# EAGLE design sensor02 (EAGLE 7.2.0)
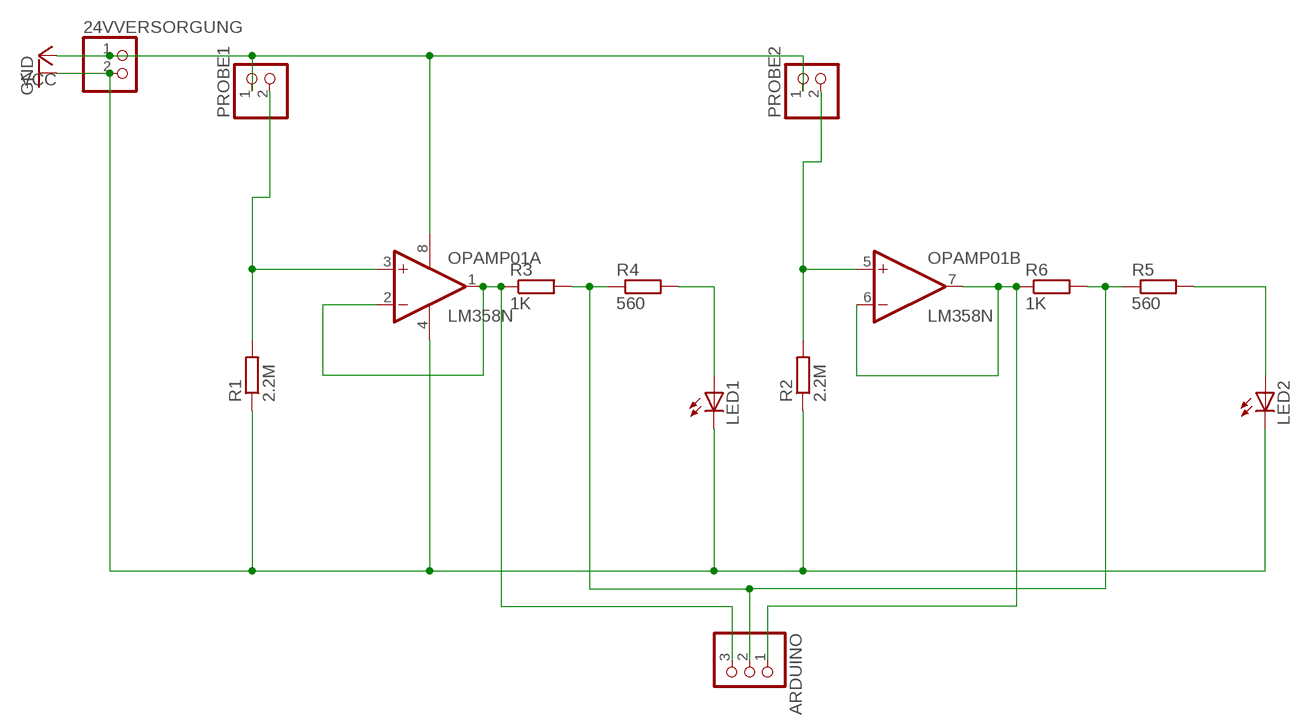
[diagram p0: schematic, sheet 1]

## Parts
24VVERSORGUNG  PINHD-1X2  [1X02]
ARDUINO  PINHD-1X3  [1X03]
LED1  LED5MM  [LED5MM]
LED2  LED5MM  [LED5MM]
OPAMP01  LM358N  [DIL08]
PROBE1  PINHD-1X2  [1X02]
PROBE2  PINHD-1X2  [1X02]
R1  2.2M  R-EU_0207/7  [0207/7]
R2  2.2M  R-EU_0207/7  [0207/7]
R3  1K  R-EU_0207/7  [0207/7]
R4  560  R-EU_0207/7  [0207/7]
R5  560  R-EU_0207/7  [0207/7]
R6  1K  R-EU_0207/7  [0207/7]

## Nets
GND: 24VVERSORGUNG.2 LED1.K(C) LED2.K(C) OPAMP01.4(P:V-) R1.1 R2.1
N$1: OPAMP01.3(A:+IN) PROBE1.2 R1.2
N$2: OPAMP01.5(B:+IN) PROBE2.2 R2.2
N$3: ARDUINO.3 OPAMP01.1(A:OUT) OPAMP01.2(A:-IN) R3.1
N$4: LED1.A R4.2
N$6: ARDUINO.1 OPAMP01.6(B:-IN) OPAMP01.7(B:OUT) R6.1
N$7: ARDUINO.2 R3.2 R4.1 R5.1 R6.2
N$8: LED2.A R5.2
VCC: 24VVERSORGUNG.1 OPAMP01.8(P:V+) PROBE1.1 PROBE2.1

## Library data of the parts
24VVERSORGUNG PROBE1 PROBE2 = pinhead:PINHD-1X2: PIN HEADER
ARDUINO = pinhead:PINHD-1X3: PIN HEADER
LED1 LED2 = led:LED: LED OSRAM: - CHIPLED LG R971, LG N971, LY N971, LG Q971, LY Q971, LO R971, LY R971 LH N974, LH R974 LS Q976, LO Q976, LY Q976 LO Q996 - Hyper CHIPLED LW Q18S LB Q993, LB Q99A, LB R99A - SideLED LS A670, LO A670, LY A670, LG A670, LP A670 LB A673, LV A673, LT A673, LW A673 LH A674 LY A675 LS A676, LA A676, LO A676, LY A676, LW A676 LS A679, LY A679, LG A679 - Hyper Micro SIDELED® LS Y876, LA Y876, LO Y876, LY Y876 LT Y87S - SmartLED LW L88C, LW L88S LB L89C, LB L89S, LG L890 LS L89K, LO L89K, LY L89K LS L896, LA L896, LO L896, LY L896 - TOPLED LS T670, LO T670, LY T670, LG T670, LP T670 LSG T670, LSP T670, LSY T670, LOP T670, LYG T670 LG T671, LOG T671, LSG T671 LB T673, LV T673, LT T673, LW T673 LH T674 LS T676, LA T676, LO T676, LY T676, LB T676, LH T676, LSB T676, LW T676 LB T67C, LV T67C, LT T67C, LS T67K, LO T67K, LY T67K, LW E67C LS E67B, LA E67B, LO E67B, LY E67B, LB E67C, LV E67C, LT E67C LW T67C LS T679, LY T679, LG T679 LS T770, LO T770, LY T770, LG T770, LP T770 LB T773, LV T773, LT T773, LW T773 LH T774 LS E675, LA E675, LY E675, LS T675 LS T776, LA T776, LO T776, LY T776, LB T776 LHGB T686 LT T68C, LB T68C - Hyper Mini TOPLED® LB M676 - Mini TOPLED Santana® LG M470 LS M47K, LO M47K, LY M47K Source: http://www.osram.convergy.de LUXEON: - LUMILED® LXK2-PW12-R00, LXK2-PW12-S00, LXK2-PW14-U00, LXK2-PW14-V00 LXK2-PM12-R00, LXK2-PM12-S00, LXK2-PM14-U00 LXK2-PE12-Q00, LXK2-PE12-R00, LXK2-PE12-S00, LXK2-PE14-T00, LXK2-PE14-U00 LXK2-PB12-K00, LXK2-PB12-L00, LXK2-PB12-M00, LXK2-PB14-N00, LXK2-PB14-P00, LXK2-PB14-Q00 LXK2-PR12-L00, LXK2-PR12-M00, LXK2-PR14-Q00, LXK2-PR14-R00 LXK2-PD12-Q00, LXK2-PD12-R00, LXK2-PD12-S00 LXK2-PH12-R00, LXK2-PH12-S00 LXK2-PL12-P00, LXK2-PL12-Q00, LXK2-PL12-R00 Source: www.luxeon.com KINGBRIGHT: KA-3528ASYC Source: www.kingbright.com
OPAMP01 = linear:LM358: OP AMP also LM158; LM258; LM2904 Source: http://cache.national.com/ds/LM/LM158.pdf
R1-R6 = rcl:R-EU_: RESISTOR, European symbol

## Board
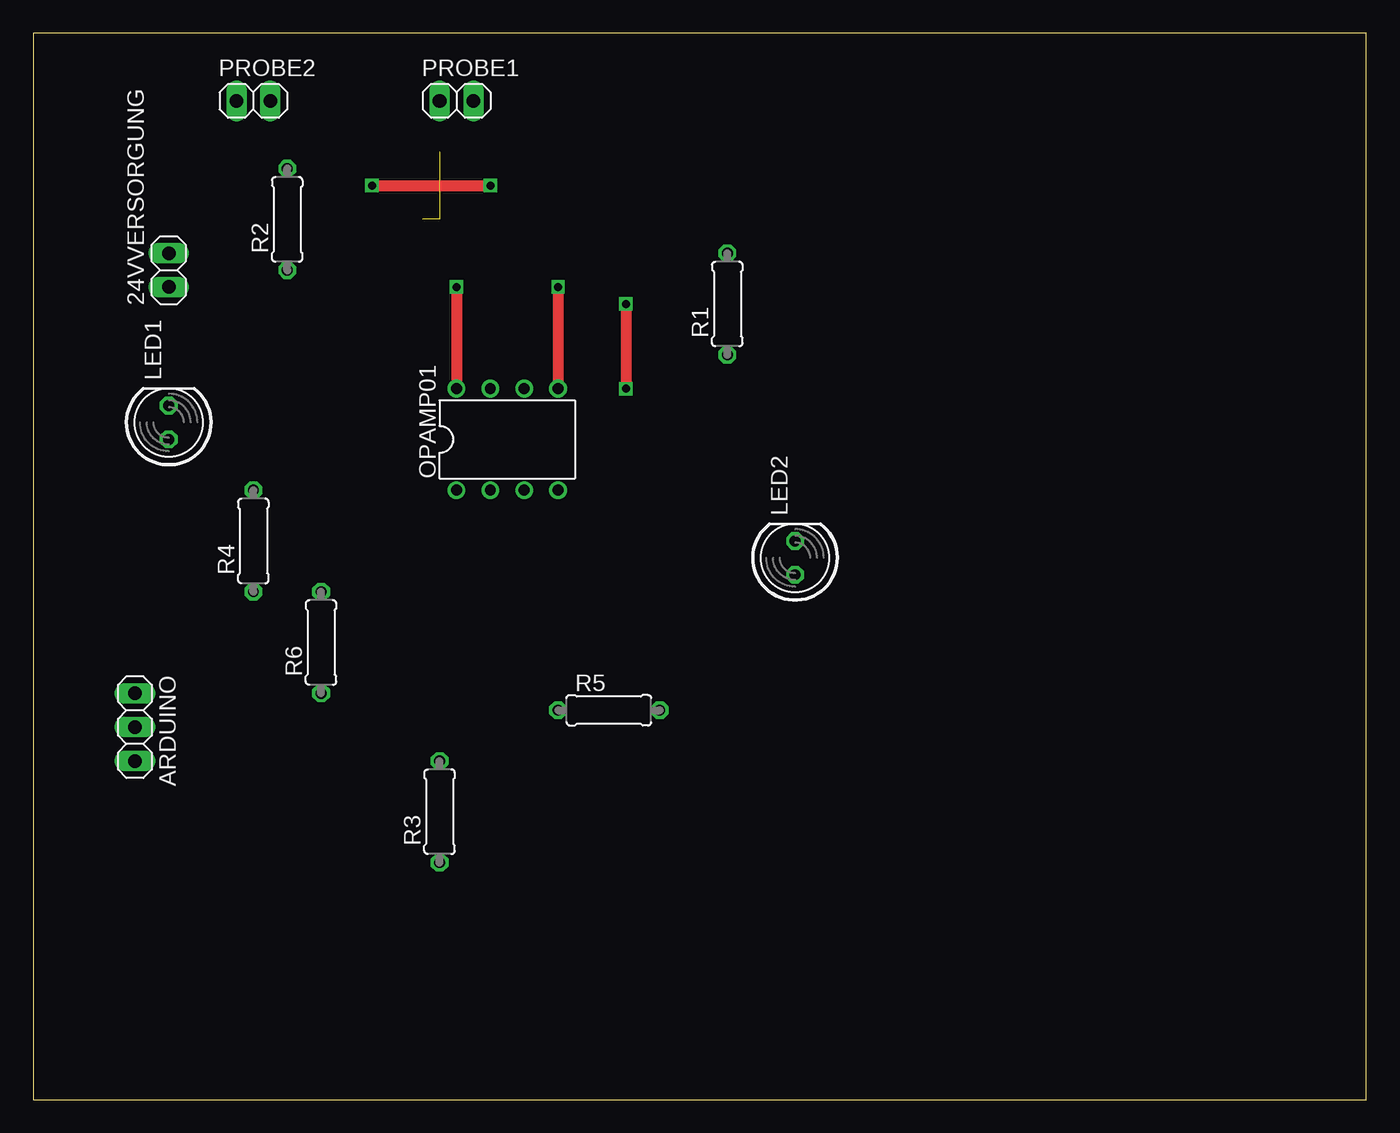
[diagram p1: board, top side]
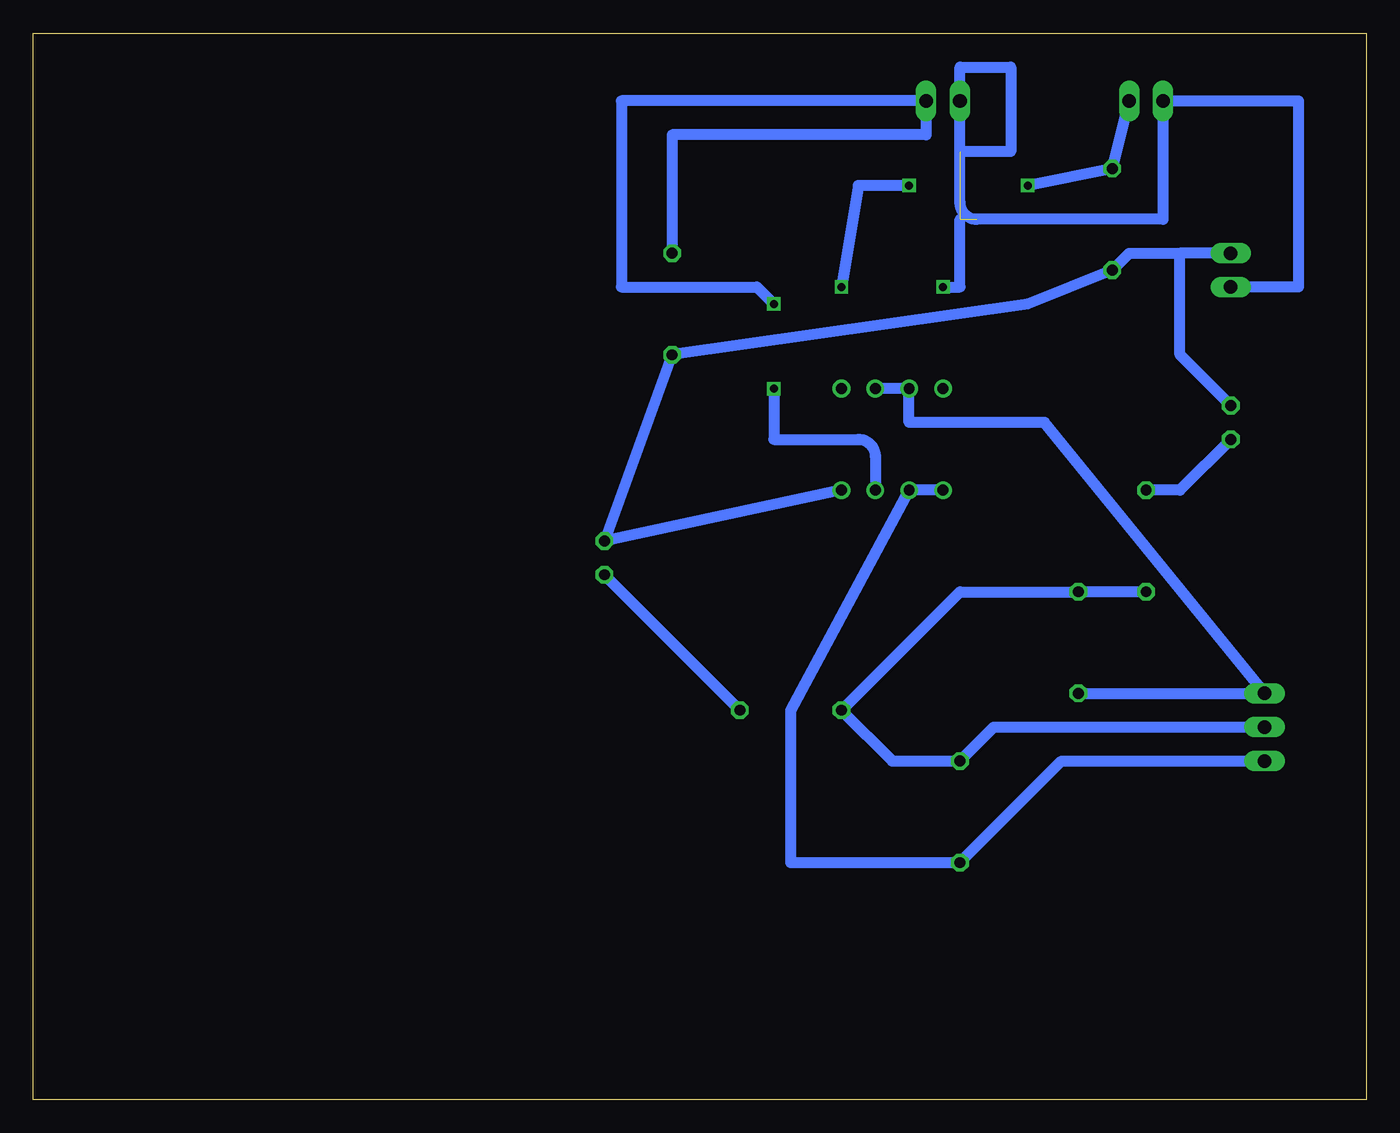
[diagram p2: board, bottom side, seen from below]

Size 100 x 80 mm. Coordinates in mm from the lower left corner, seen from the top.
Outline: 0,0 100,0 100,80 0,80 0,0
Copper layers (1*16): Top 0.035mm / dielectric 1.5mm / Bottom 0.035mm
Design rules "default *": minimum track width 10mil, minimum drill 20mil, track to track 8mil, track to pad 8mil, pad to pad 8mil, via to via 8mil, smd to smd 8mil, copper to edge 40mil, drill to drill 8mil, minimum pad ring 10mil, minimum via ring 8mil, stop-mask expansion 4mil, vias tented up to drill 0mil, thermal gap 10mil

### Footprints (pad centres in the part's own frame; a part is rotated, then mirrored left to right if it is on the bottom)
1X02 = drill 1.016 long: 1 -1.27,0; 2 1.27,0
1X03 = drill 1.016 long: 1 -2.54,0; 2 0,0; 3 2.54,0
LED5MM = drill 0.813 octagon: A -1.27,0; K 1.27,0
DIL08 = drill 0.813 pad 1.27: 1 -3.81,-3.81; 2 -1.27,-3.81; 3 1.27,-3.81; 4 3.81,-3.81; 5 3.81,3.81; 6 1.27,3.81; 7 -1.27,3.81; 8 -3.81,3.81
0207/7 = drill 0.813 octagon: 1 -3.81,0; 2 3.81,0

### Placement (x,y rotation side)
24VVERSORGUNG  10.16,62.23 90 top
ARDUINO  7.62,27.94 270 top
LED1  10.16,50.8 90 top
LED2  57.15,40.64 90 top
OPAMP01  35.56,49.53 0 top
PROBE1  31.75,74.93 0 top
PROBE2  16.51,74.93 0 top
R1  52.07,59.69 90 top
R2  19.05,66.04 90 top
R3  30.48,21.59 90 top
R4  16.51,41.91 90 top
R5  43.18,29.21 0 top
R6  21.59,34.29 90 top

### Tracks (layer width: path | path; a pad name or v marks a point on that pad's centre or on a via)
GND
  Bottom 0.813: 13.97,63.5 17.78,63.5 R2.1 25.4,59.69 R1.1 LED2.K OPAMP01.4 | LED1.K 13.97,55.88 13.97,63.5 | 24VVERSORGUNG.2 13.97,63.5
N$1  (via drill 0.6)
  Top 0.813: v44.45,59.69 v44.45,53.34
  Bottom 0.813: v44.45,59.69 45.72,60.96 55.88,60.96 55.88,74.93 PROBE1.2 33.02,72.39 52.07,72.39 R1.2 | v44.45,53.34 44.45,49.53 38.1,49.53 arc90 36.83,48.26 OPAMP01.3
N$2  (via drill 0.6)
  Top 0.813: v25.4,68.58 v34.29,68.58 | v39.37,60.96 OPAMP01.5
  Bottom 0.813: PROBE2.2 R2.2 v25.4,68.58 | v34.29,68.58 38.1,68.58 v39.37,60.96
N$3
  Bottom 0.813: OPAMP01.1 OPAMP01.2 43.18,29.21 43.18,17.78 R3.1 22.86,25.4 ARDUINO.3
N$4
  Bottom 0.813: LED1.A 13.97,45.72 R4.2
N$6
  Bottom 0.813: R6.1 ARDUINO.1 24.13,50.8 34.29,50.8 OPAMP01.7 OPAMP01.6
N$7
  Bottom 0.813: ARDUINO.2 27.94,27.94 R3.2 35.56,25.4 R5.1 30.48,38.1 R6.2 R4.1
N$8
  Bottom 0.813: R5.2 LED2.A
VCC  (via drill 0.6)  (2 unrouted)
  Top 0.813: v31.75,60.96 OPAMP01.8
  Bottom 0.813: 30.48,71.12 30.48,67.31 arc-90 29.21,66.04 15.24,66.04 PROBE2.1 5.08,74.93 5.08,60.96 24VVERSORGUNG.1 | 30.48,71.12 PROBE1.1 30.48,77.47 26.67,77.47 26.67,71.12 30.48,71.12 | v31.75,60.96 30.48,60.96 30.48,66.04